# Altium schematic sheet Page03 PWR TREE.SchDoc
size 513 x 386 mm
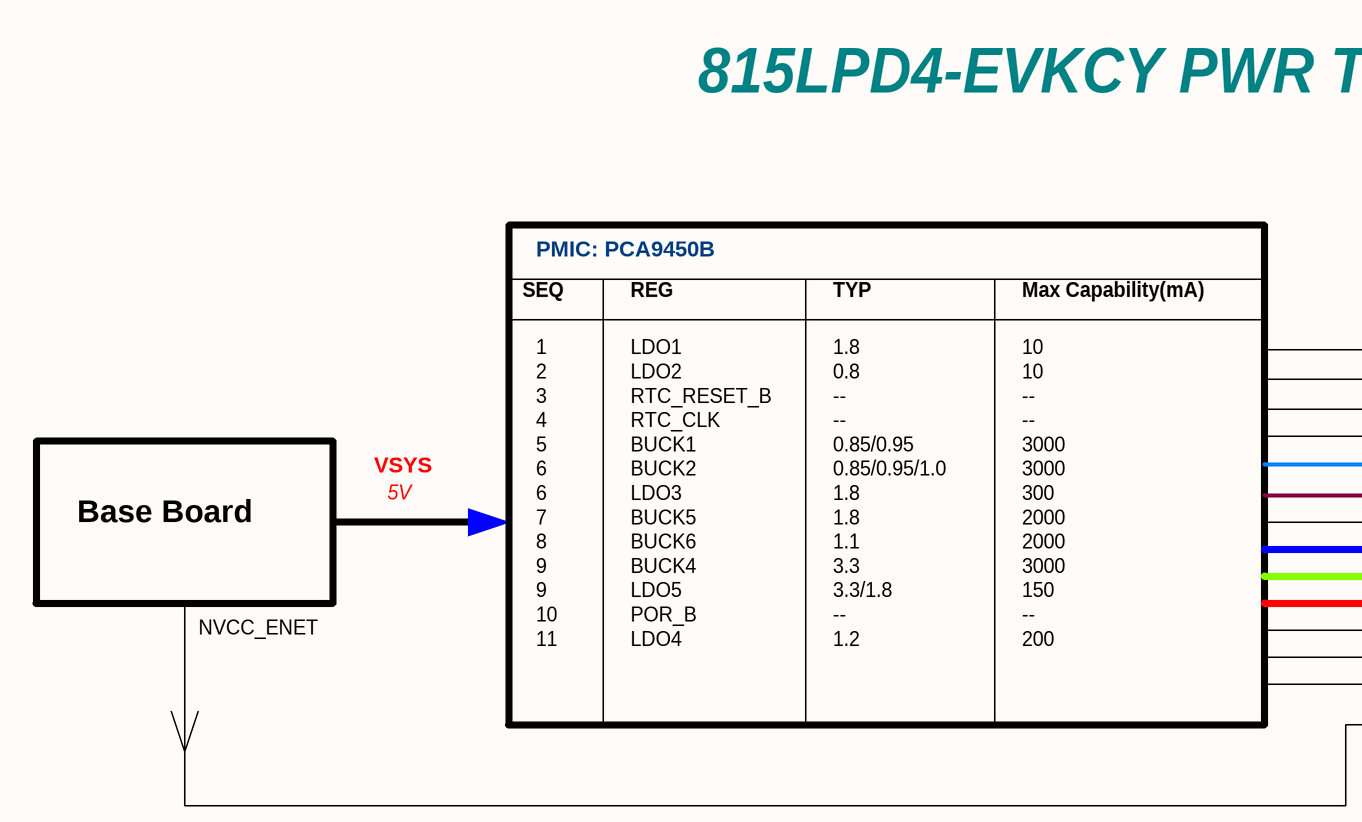
[diagram p0: Page03 PWR TREE.SchDoc, left]
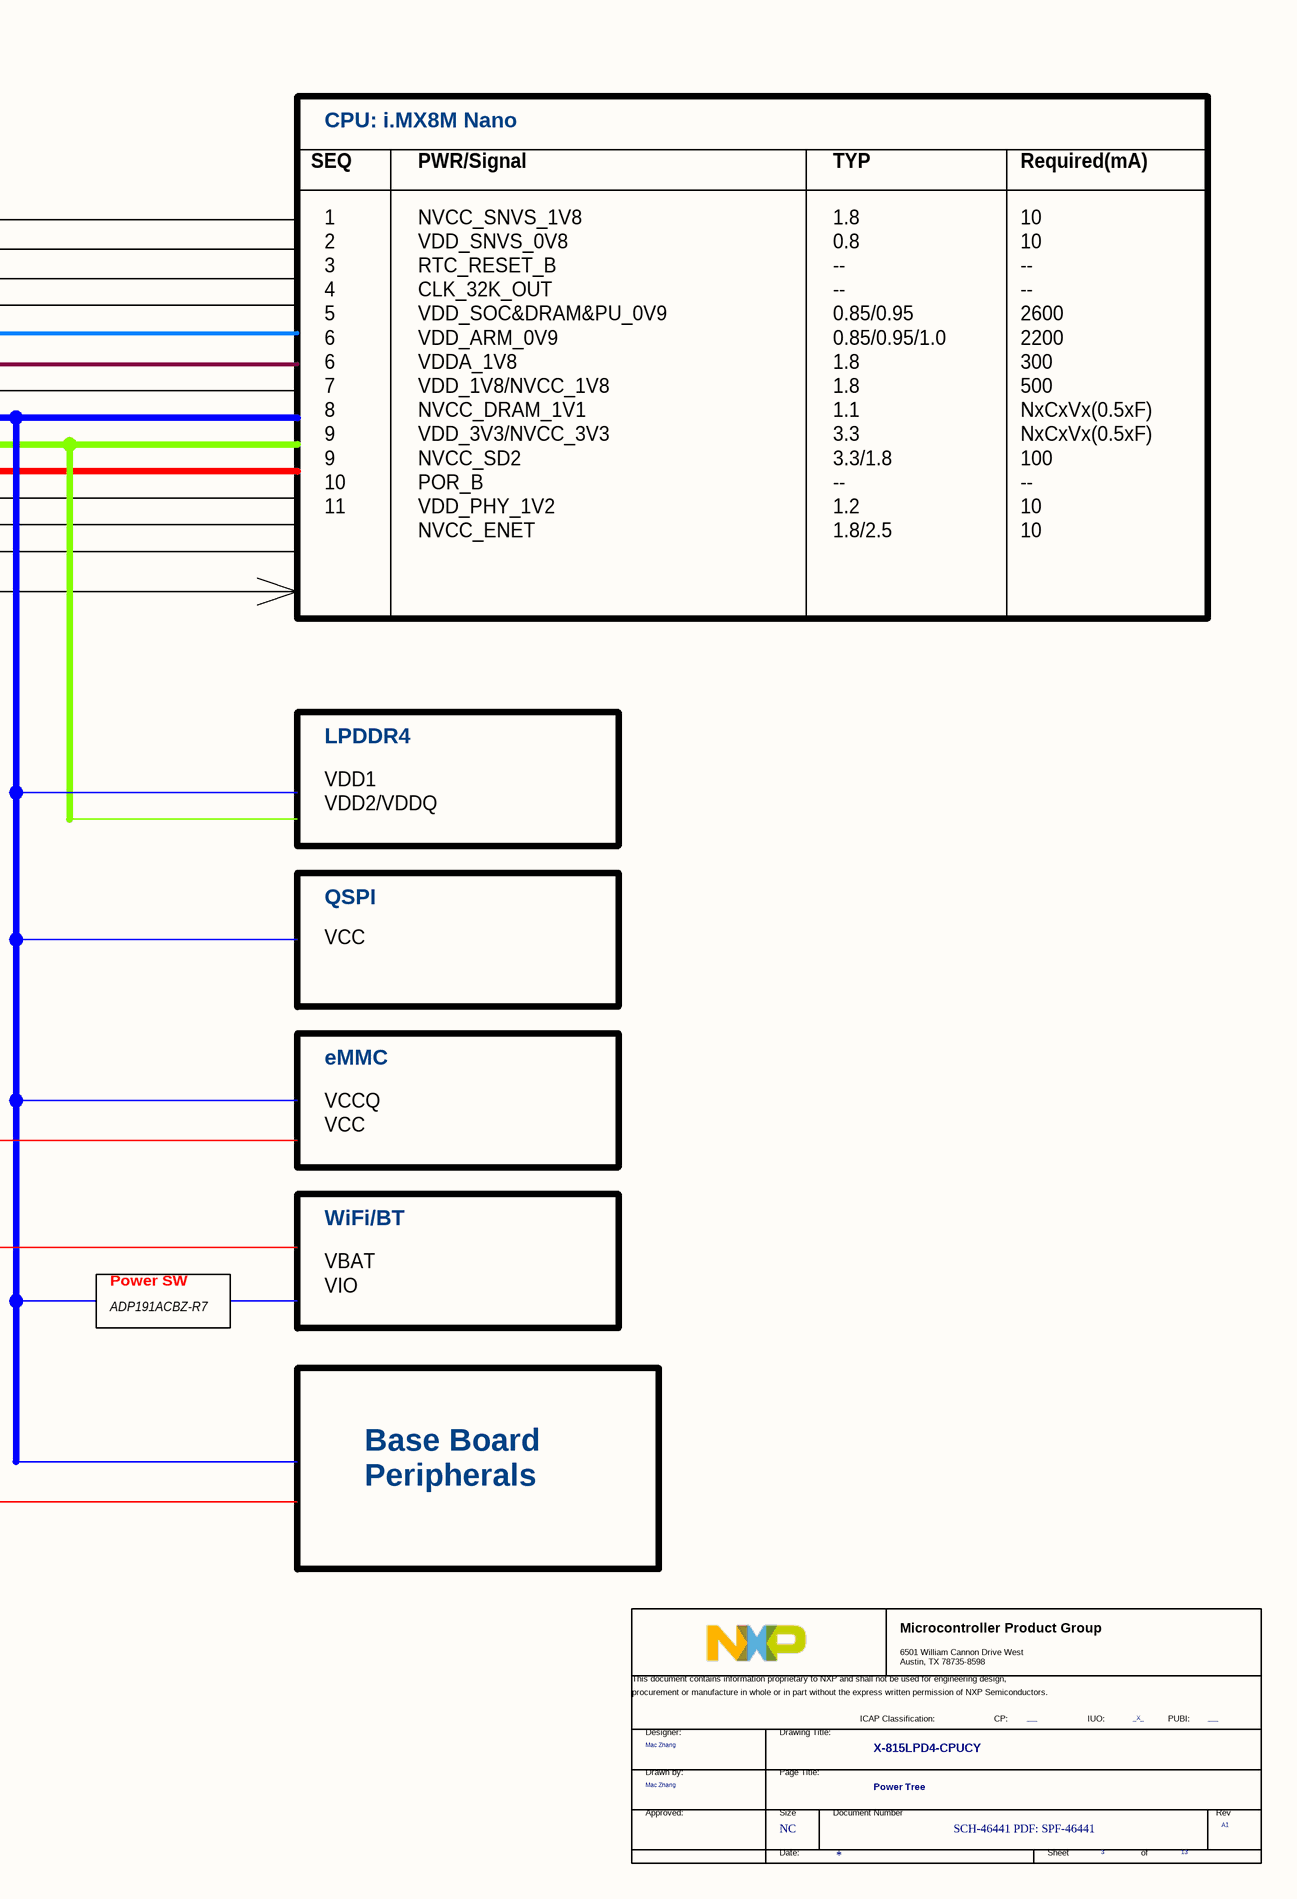
[diagram p1: Page03 PWR TREE.SchDoc, right]

## Parts
*  Doc: SCH-46441 PDF: SPF-46441  RevCode: A1  Title: X-815LPD4-CPUCY  Page Size: NC  Page Number: 3  Page Count: 13  PageTitle: Power Tree  Designer: Mac Zhang  PUBI: ___  FIUO: _X_  (hidden comment: TitleBlock_MCPG)  (graphical)

## Notes on the sheet
- 815LPD4-EVKCY PWR TREE
- PMIC: PCA9450B
- CPU: i.MX8M Nano
- SEQ
- 1
  2
  3
  4
  5
  6
  6
  7
  8
  9
  9
  10
  11
- LDO1
  LDO2
  RTC_RESET_B
  RTC_CLK
  BUCK1
  BUCK2
  LDO3
  BUCK5
  BUCK6
  BUCK4
  LDO5
  POR_B
  LDO4
- REG
- 1.8
  0.8
  --
  --
  0.85/0.95
  0.85/0.95/1.0
  1.8
  1.8
  1.1
  3.3
  3.3/1.8
  --
  1.2
- TYP
- 10
  10
  --
  --
  3000
  3000
  300
  2000
  2000
  3000
  150
  --
  200
- Max Capability(mA)
- NVCC_SNVS_1V8
  VDD_SNVS_0V8
  RTC_RESET_B
  CLK_32K_OUT
  VDD_SOC&DRAM&PU_0V9
  VDD_ARM_0V9
  VDDA_1V8
  VDD_1V8/NVCC_1V8
  NVCC_DRAM_1V1
  VDD_3V3/NVCC_3V3
  NVCC_SD2
  POR_B
  VDD_PHY_1V2
  NVCC_ENET
- PWR/Signal
- 1.8
  0.8
  --
  --
  0.85/0.95
  0.85/0.95/1.0
  1.8
  1.8
  1.1
  3.3
  3.3/1.8
  --
  1.2
  1.8/2.5
- 10
  10
  --
  --
  2600
  2200
  300
  500
  NxCxVx(0.5xF)
  NxCxVx(0.5xF)
  100
  --
  10
  10
- Required(mA)
- VSYS
- Base Board
- 5V
- NVCC_ENET
- VDD1
  VDD2/VDDQ
- LPDDR4
- VCC
- QSPI
- VCCQ
  VCC
- eMMC
- WiFi/BT
- Power SW
- VBAT
  VIO
- ADP191ACBZ-R7
- Base Board
  Peripherals
- (in symbol TitleBlock_MCPG) Microcontroller Product Group; 6501 William Cannon Drive West / Austin, TX 78735-8598; This document contains information proprietary to NXP and shall not be used for engineering design,; procurement or manufacture in whole or in part without the express written permission of NXP Semiconductors.; ICAP Classification:; CP:; IUO:; PUBI:; Designer:; Drawing Title:; Drawn by:; Page Title:; Approved:; Size; Document Number; Rev; Date:; Sheet; of

## Library data of the parts
* = TitleBlock_MCPG: OrgName: NXP Semiconductor; OrgAddr1: NO. 192 Liangjing Rd. Pudong New Area, ShangHai; Page Create Date: March  8, 1995; DrawnBy: Mac Zhang; FCP: ___; Page Modify Date: *